# Altium schematic sheet MAX11043.SchDoc
size A4
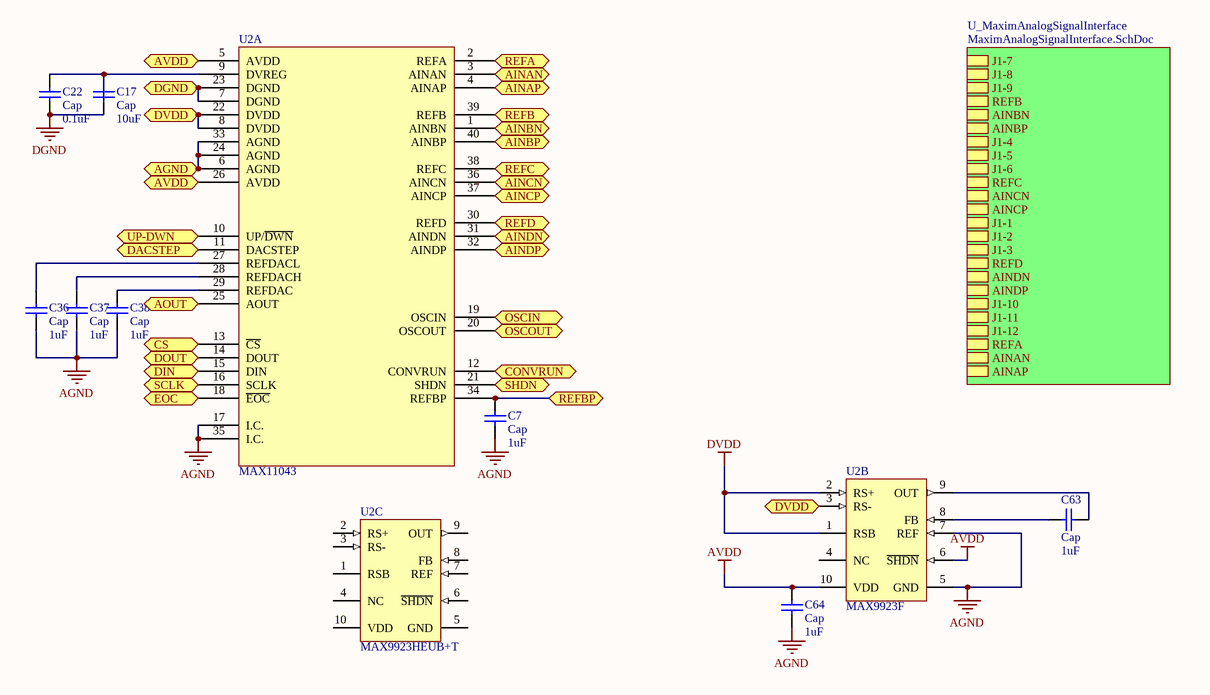
[diagram p0: MAX11043.SchDoc]

## Parts
C7  Cap  value 1uF  [RAD-0.3]
C17  Cap  value 10uF  [RAD-0.3]
C22  Cap  value 0.1uF  [RAD-0.3]
C36  Cap  value 1uF  [RAD-0.3]
C37  Cap  value 1uF  [RAD-0.3]
C38  Cap  value 1uF  [RAD-0.3]
C63  Cap  value 1uF  [RAD-0.3]
C64  Cap  value 1uF  [RAD-0.3]
U2A  MAX11043
U2B  MAX9923F  [MAXM-U10+2_N]
U2C  MAX9923HEUB+T  [MAXM-U10+2_N]

## Sub-sheets
U_MaximAnalogSignalInterface = MaximAnalogSignalInterface.SchDoc: J1-7, J1-8, J1-9, REFB, AINBN, AINBP, J1-4, J1-5, J1-6, REFC, AINCN, AINCP, J1-1, J1-2, J1-3, REFD, AINDN, AINDP, J1-10, J1-11, J1-12, REFA, AINAN, AINAP

## Ports
AGND, AINAN, AINAP, AINBN, AINBP, AINCN, AINCP, AINDN, AINDP, AOUT, AVDD, CONVRUN, CS, DACSTEP, DGND, DIN, DOUT, DVDD, EOC, OSCIN, OSCOUT, REFA, REFB, REFBP, REFC, REFD, SCLK, SHDN, UP-DWN

## Nets
AGND: C7.2 C36.1 C37.2 C38.1 C64.1 U2A.17(I.C.) U2A.35(I.C.) U2B.5(GND) U2B.7(REF)
AVDD: C64.2 U2B.6(~{SHDN}) U2B.10(VDD)
DGND: C17.2 C22.2
DVDD: U2B.1(RSB) U2B.2(RS+)
AGND: U2A.6(AGND) U2A.24(AGND) U2A.33(AGND) ; port AGND  [a separate net that carries the same name]
AINAN: U2A.3(AINAN) ; port AINAN
AINAP: U2A.4(AINAP) ; port AINAP
AINBN: U2A.1(AINBN) ; port AINBN
AINBP: U2A.40(AINBP) ; port AINBP
AINCN: U2A.36(AINCN) ; port AINCN
AINCP: U2A.37(AINCP) ; port AINCP
AINDN: U2A.31(AINDN) ; port AINDN
AINDP: U2A.32(AINDP) ; port AINDP
AOUT: U2A.25(AOUT) ; port AOUT
AVDD: U2A.5(AVDD) U2A.26(AVDD) ; port AVDD  [a separate net that carries the same name]
CONVRUN: U2A.12(CONVRUN) ; port CONVRUN
CS: U2A.13(~{CS}) ; port CS
DACSTEP: U2A.11(DACSTEP) ; port DACSTEP
DGND: U2A.7(DGND) U2A.23(DGND) ; port DGND  [a separate net that carries the same name]
DIN: U2A.15(DIN) ; port DIN
DOUT: U2A.14(DOUT) ; port DOUT
DVDD: U2A.8(DVDD) U2A.22(DVDD) U2B.3(RS-) ; port DVDD  [a separate net that carries the same name]
EOC: U2A.18(~{EOC}) ; port EOC
OSCIN: U2A.19(OSCIN) ; port OSCIN
OSCOUT: U2A.20(OSCOUT) ; port OSCOUT
REFA: U2A.2(REFA) ; port REFA
REFB: U2A.39(REFB) ; port REFB
REFBP: C7.1 U2A.34(REFBP) ; port REFBP
REFC: U2A.38(REFC) ; port REFC
REFD: U2A.30(REFD) ; port REFD
SCLK: U2A.16(SCLK) ; port SCLK
SHDN: U2A.21(SHDN) ; port SHDN
UP-DWN: U2A.10(UP/~{DWN}) ; port UP-DWN
NetC17_1: C17.1 C22.1 U2A.9(DVREG)
NetC36_2: C36.2 U2A.27(REFDACL)
NetC37_1: C37.1 U2A.28(REFDACH)
NetC38_2: C38.2 U2A.29(REFDAC)
NetC63_1: C63.1 U2B.8(FB)
NetC63_2: C63.2 U2B.9(OUT)

Not connected (* = marked no-connect by the designer): U2B 4(NC); U2C 1(RSB) 2(RS+) 3(RS-) 4(NC) 5(GND) 6(~{SHDN}) 7(REF) 8(FB) 9(OUT) 10(VDD)

## Library data of the parts
C7 C17 C22 C36-C38 C63 C64 = Cap: Capacitor; Published: 8-Jun-2000; LatestRevisionDate: 17-Jul-2002; LatestRevisionNote: Re-released for DXP Platform.; PackageReference: RAD-0.3; Publisher: Altium Limited; PackageDescription: Radial Cap, Thru-Hole; 2 Leads; 0.3 in Pin Spacing
U2B = CMP-0252-00092-1: Ultra-Precision, High-Side Current-Sense Amplifier with Fixed Gain, 100 V / V Gain, -40 to 85 degC, 10-Pin SOP (U10+2), Pb-Free, Tape and Reel; PartNumber: MAX9923HEUB+T; Gain: 25 V/V, 100 V/V ,250 V/V; Bi-Dir. Curr. Sense: Yes; ComponentLink3Description: Package Specification; ComponentLink2Description: Datasheet; ComponentLink1Description: Manufacturer URL; ComponentLink3URL: http://pdfserv.maximintegrated.com/package_dwgs/21-0061.PDF; PackageReference: U10+2; PackageDescription: 10-Pin Micro-MAX, Thin Shrink Small-Outline (U10+2), Body 3 x 3 mm, Pitch 0.5 mm; PackageVersion: Rev. L, 07/2008; Mounting Technology: Surface Mount; ComponentLink2URL: http://datasheets.maximintegrated.com/en/ds/MAX9922-MAX9923.pdf; ComponentLink1URL: http://www.maximintegrated.com/; Code_JEDEC: MO-187; DatasheetVersion: Rev. 1
U2C = CMP-0252-00092-1: Ultra-Precision, High-Side Current-Sense Amplifier with Fixed Gain, 100 V / V Gain, -40 to 85 degC, 10-Pin SOP (U10+2), Pb-Free, Tape and Reel; Gain: 25 V/V, 100 V/V ,250 V/V; Bi-Dir. Curr. Sense: Yes; PartNumber: MAX9923HEUB+T; ComponentLink3Description: Package Specification; ComponentLink2Description: Datasheet; ComponentLink1Description: Manufacturer URL; ComponentLink3URL: http://pdfserv.maximintegrated.com/package_dwgs/21-0061.PDF; PackageReference: U10+2; PackageDescription: 10-Pin Micro-MAX, Thin Shrink Small-Outline (U10+2), Body 3 x 3 mm, Pitch 0.5 mm; PackageVersion: Rev. L, 07/2008; Mounting Technology: Surface Mount; ComponentLink2URL: http://datasheets.maximintegrated.com/en/ds/MAX9922-MAX9923.pdf; ComponentLink1URL: http://www.maximintegrated.com/; Code_JEDEC: MO-187; DatasheetVersion: Rev. 1